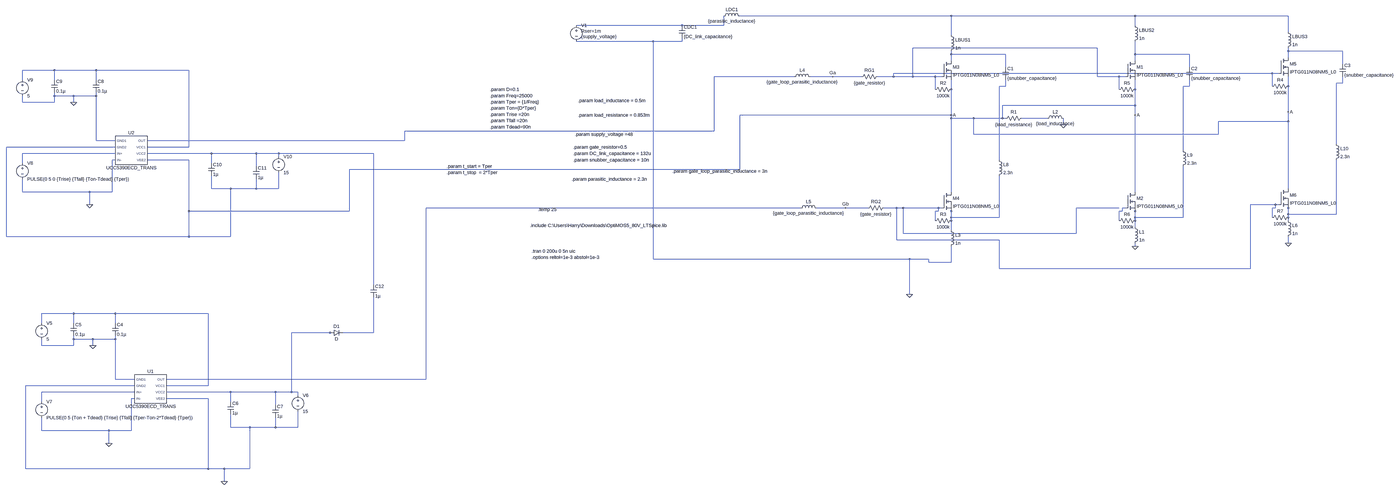
[diagram p0: schematic gate_driver_implementation_3_in_parallel_start_up_conditions.asc, whole sheet]
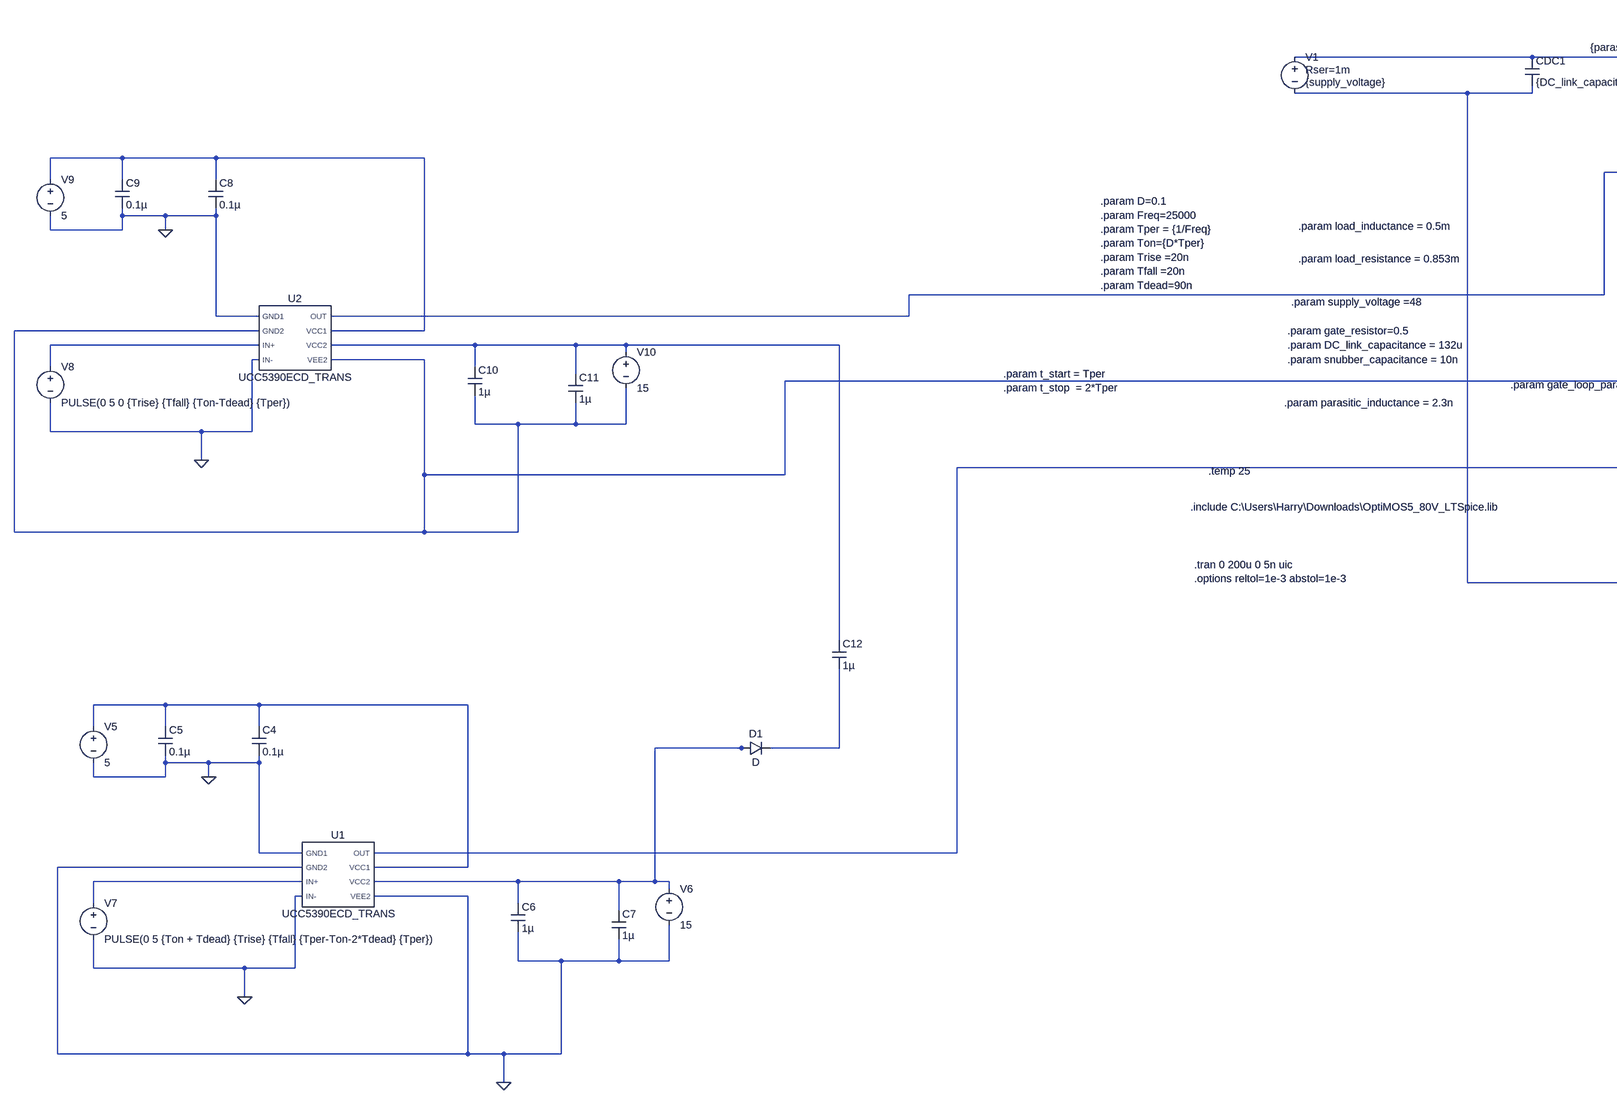
[diagram p1: schematic gate_driver_implementation_3_in_parallel_start_up_conditions.asc, part, row 1 of 1, column 1 of 2]
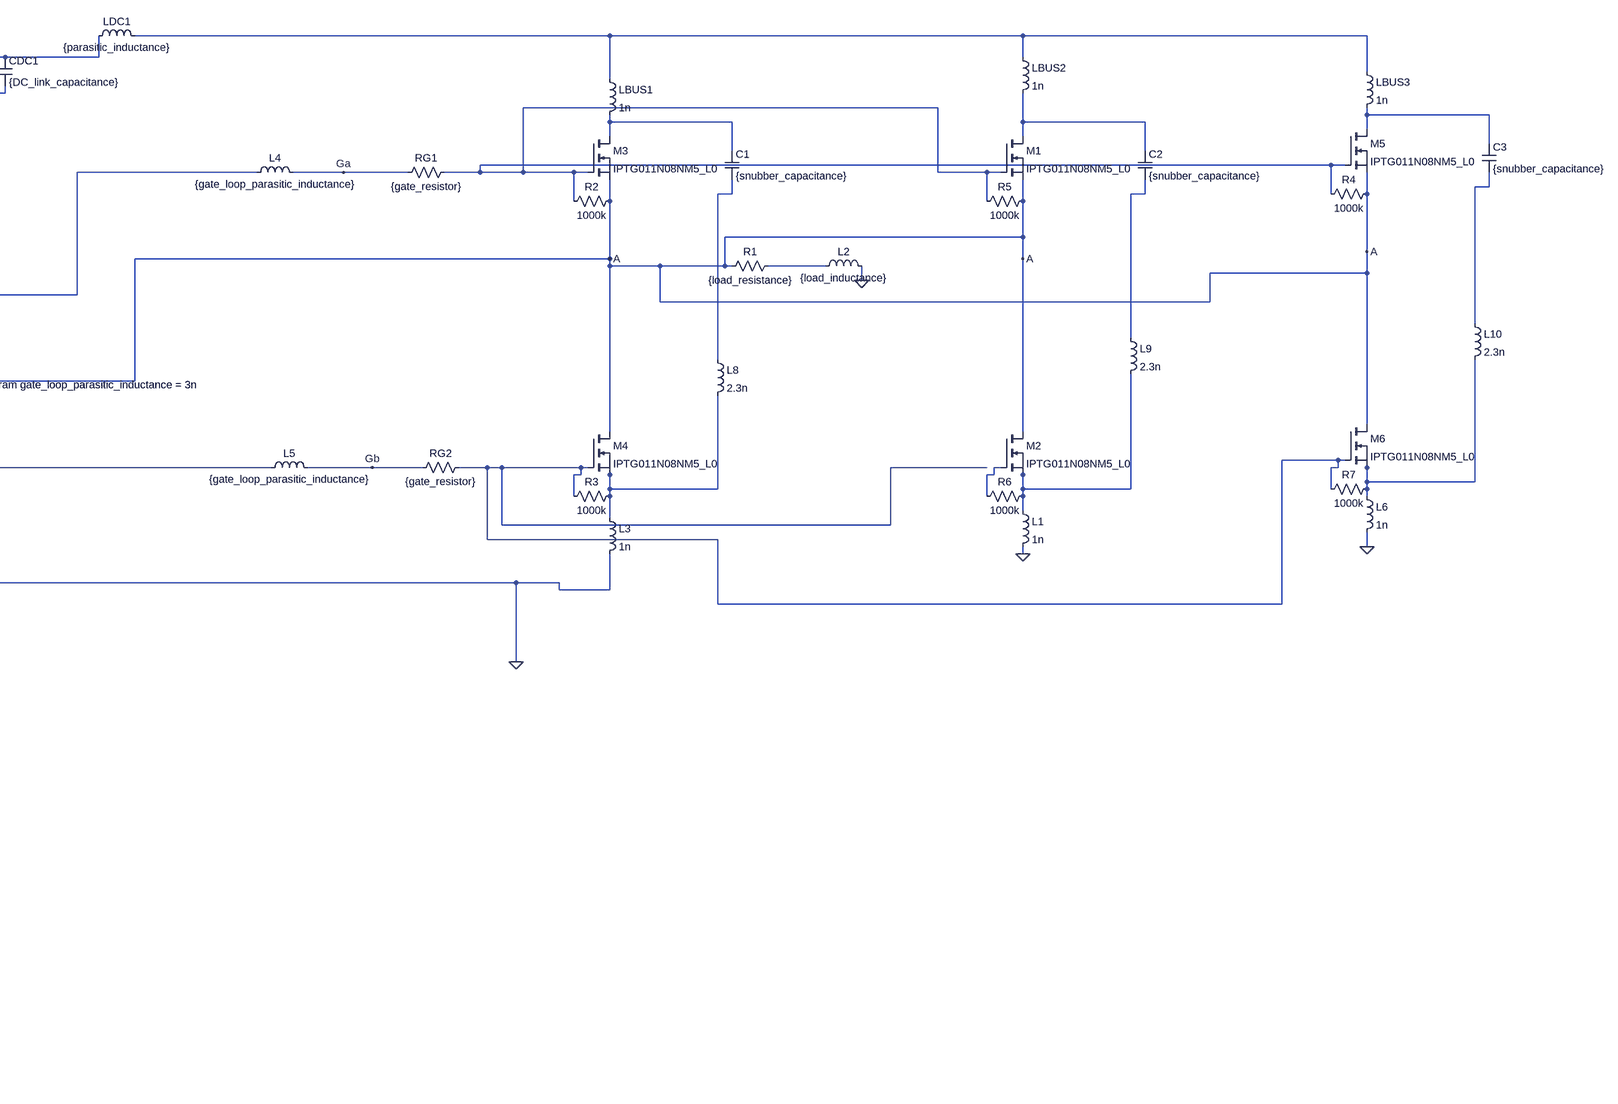
[diagram p2: schematic gate_driver_implementation_3_in_parallel_start_up_conditions.asc, part, row 1 of 1, column 2 of 2]
gate_driver_implementation_3_in_parallel_start_up_conditions.asc, the LTspice schematic file:
Version 4.1
SHEET 1 7924 1844
WIRE 1136 -560 80 -560
WIRE 2176 -560 1136 -560
WIRE 3136 -560 2176 -560
WIRE -208 -512 -736 -512
WIRE 0 -512 0 -560
WIRE 0 -512 -208 -512
WIRE 2176 -512 2176 -560
WIRE 3136 -480 3136 -560
WIRE 1136 -464 1136 -560
WIRE -352 -432 -736 -432
WIRE -208 -432 -208 -448
WIRE -208 -432 -352 -432
WIRE 1920 -400 944 -400
WIRE 3136 -384 3136 -400
WIRE 3408 -384 3136 -384
WIRE 1136 -368 1136 -384
WIRE 1408 -368 1136 -368
WIRE 2176 -368 2176 -432
WIRE 2448 -368 2176 -368
WIRE 3136 -352 3136 -384
WIRE 1136 -336 1136 -368
WIRE 2176 -336 2176 -368
WIRE 3408 -320 3408 -384
WIRE 1408 -304 1408 -368
WIRE 2448 -304 2448 -368
WIRE -4048 -288 -4208 -288
WIRE -3840 -288 -4048 -288
WIRE -3376 -288 -3840 -288
WIRE 3056 -272 848 -272
WIRE 3088 -272 3056 -272
WIRE 352 -256 -48 -256
WIRE 544 -256 432 -256
WIRE 688 -256 544 -256
WIRE 848 -256 848 -272
WIRE 848 -256 768 -256
WIRE 944 -256 944 -400
WIRE 944 -256 848 -256
WIRE 1056 -256 944 -256
WIRE 1088 -256 1056 -256
WIRE 1920 -256 1920 -400
WIRE 2096 -256 1920 -256
WIRE 2128 -256 2096 -256
WIRE -4208 -240 -4208 -288
WIRE -4048 -240 -4048 -288
WIRE -3840 -240 -3840 -288
WIRE 3408 -224 3408 -256
WIRE 3408 -224 3376 -224
WIRE 1408 -208 1408 -240
WIRE 1408 -208 1376 -208
WIRE 2448 -208 2448 -240
WIRE 2448 -208 2416 -208
WIRE 3056 -208 3056 -272
WIRE 3136 -208 3136 -256
WIRE 1056 -192 1056 -256
WIRE 1136 -192 1136 -240
WIRE 2096 -192 2096 -256
WIRE 2176 -192 2176 -240
WIRE -4048 -160 -4048 -176
WIRE -3952 -160 -4048 -160
WIRE -3840 -160 -3840 -176
WIRE -3840 -160 -3952 -160
WIRE -4208 -128 -4208 -160
WIRE -4048 -128 -4048 -160
WIRE -4048 -128 -4208 -128
WIRE -3952 -128 -3952 -160
WIRE 2176 -112 2176 -192
WIRE 2176 -112 1392 -112
WIRE 3136 -80 3136 -208
WIRE 1136 -64 1136 -192
WIRE 1136 -64 80 -64
WIRE 2176 -64 2176 -112
WIRE 1136 -48 1136 -64
WIRE 1248 -48 1136 -48
WIRE 1392 -48 1392 -112
WIRE 1392 -48 1248 -48
WIRE 1408 -48 1392 -48
WIRE 1616 -48 1488 -48
WIRE 3136 -32 3136 -80
WIRE 3136 -32 2592 -32
WIRE 1696 -16 1696 -48
WIRE -48 16 -48 -256
WIRE -48 16 -1952 16
WIRE 1248 32 1248 -48
WIRE 2592 32 2592 -32
WIRE 2592 32 1248 32
WIRE -3840 64 -3840 -160
WIRE -3744 64 -3840 64
WIRE -1952 64 -1952 16
WIRE -1952 64 -3584 64
WIRE 3376 80 3376 -224
WIRE -3744 96 -4288 96
WIRE -3376 96 -3376 -288
WIRE -3376 96 -3584 96
WIRE 2416 112 2416 -208
WIRE -3744 128 -4208 128
WIRE -3264 128 -3584 128
WIRE -3040 128 -3264 128
WIRE -2928 128 -3040 128
WIRE -2384 128 -2928 128
WIRE -2928 144 -2928 128
WIRE -3744 160 -3760 160
WIRE -3376 160 -3584 160
WIRE 1376 160 1376 -208
WIRE -4208 176 -4208 128
WIRE -3264 176 -3264 128
WIRE -3040 192 -3040 128
WIRE 80 208 80 -64
WIRE 80 208 -2560 208
WIRE -3264 304 -3264 240
WIRE -3168 304 -3264 304
WIRE -3040 304 -3040 256
WIRE -3040 304 -3168 304
WIRE -2928 304 -2928 224
WIRE -2928 304 -3040 304
WIRE 3136 304 3136 -32
WIRE -4208 320 -4208 256
WIRE -3872 320 -4208 320
WIRE -3760 320 -3760 160
WIRE -3760 320 -3872 320
WIRE 1136 320 1136 -48
WIRE 2176 320 2176 -64
WIRE -3872 384 -3872 320
WIRE 3072 384 2752 384
WIRE 3088 384 3072 384
WIRE 384 400 -1792 400
WIRE 608 400 464 400
WIRE 720 400 608 400
WIRE 864 400 800 400
WIRE 896 400 864 400
WIRE 1072 400 896 400
WIRE 1088 400 1072 400
WIRE 2096 400 1760 400
WIRE 2128 400 2112 400
WIRE 3072 400 3072 384
WIRE 3072 400 3056 400
WIRE 3136 400 3136 384
WIRE -3376 416 -3376 160
WIRE -2560 416 -2560 208
WIRE -2560 416 -3376 416
WIRE 1072 416 1072 400
WIRE 1072 416 1056 416
WIRE 1136 416 1136 400
WIRE 2112 416 2112 400
WIRE 2112 416 2096 416
WIRE 2176 416 2176 400
WIRE 3136 432 3136 400
WIRE 3376 432 3376 160
WIRE 3376 432 3136 432
WIRE 1136 448 1136 416
WIRE 1376 448 1376 240
WIRE 1376 448 1136 448
WIRE 2176 448 2176 416
WIRE 2416 448 2416 192
WIRE 2416 448 2176 448
WIRE 3056 448 3056 400
WIRE 3136 448 3136 432
WIRE 1056 464 1056 416
WIRE 1136 464 1136 448
WIRE 2096 464 2096 416
WIRE 2176 464 2176 448
WIRE 3136 464 3136 448
WIRE 2176 496 2176 464
WIRE 1136 512 1136 464
WIRE 896 528 896 400
WIRE 1760 528 1760 400
WIRE 1760 528 896 528
WIRE -4288 544 -4288 96
WIRE -3376 544 -3376 416
WIRE -3376 544 -4288 544
WIRE -3168 544 -3168 304
WIRE -3168 544 -3376 544
WIRE 864 560 864 400
WIRE 1376 560 864 560
WIRE 3136 576 3136 544
WIRE 2176 592 2176 576
WIRE -352 656 -352 -432
WIRE 928 656 -352 656
WIRE 1024 656 928 656
WIRE 1024 672 1024 656
WIRE 1136 672 1136 592
WIRE 1136 672 1024 672
WIRE 1376 704 1376 560
WIRE 2752 704 2752 384
WIRE 2752 704 1376 704
WIRE -2384 784 -2384 128
WIRE 928 832 928 656
WIRE -3952 928 -4112 928
WIRE -3744 928 -3952 928
WIRE -3280 928 -3744 928
WIRE -4112 976 -4112 928
WIRE -3952 976 -3952 928
WIRE -3744 976 -3744 928
WIRE -2656 1024 -2864 1024
WIRE -2640 1024 -2656 1024
WIRE -2384 1024 -2384 848
WIRE -2384 1024 -2592 1024
WIRE -3952 1056 -3952 1040
WIRE -3856 1056 -3952 1056
WIRE -3744 1056 -3744 1040
WIRE -3744 1056 -3856 1056
WIRE -4112 1088 -4112 1056
WIRE -3952 1088 -3952 1056
WIRE -3952 1088 -4112 1088
WIRE -3856 1088 -3856 1056
WIRE -3744 1280 -3744 1056
WIRE -3648 1280 -3744 1280
WIRE -1792 1280 -1792 400
WIRE -1792 1280 -3488 1280
WIRE -3648 1312 -4192 1312
WIRE -3280 1312 -3280 928
WIRE -3280 1312 -3488 1312
WIRE -3648 1344 -4112 1344
WIRE -3168 1344 -3488 1344
WIRE -2944 1344 -3168 1344
WIRE -2864 1344 -2864 1024
WIRE -2864 1344 -2944 1344
WIRE -2832 1344 -2864 1344
WIRE -2832 1360 -2832 1344
WIRE -3648 1376 -3664 1376
WIRE -3280 1376 -3488 1376
WIRE -4112 1392 -4112 1344
WIRE -3168 1392 -3168 1344
WIRE -2944 1408 -2944 1344
WIRE -3168 1520 -3168 1456
WIRE -3072 1520 -3168 1520
WIRE -2944 1520 -2944 1472
WIRE -2944 1520 -3072 1520
WIRE -2832 1520 -2832 1440
WIRE -2832 1520 -2944 1520
WIRE -4112 1536 -4112 1472
WIRE -3776 1536 -4112 1536
WIRE -3664 1536 -3664 1376
WIRE -3664 1536 -3776 1536
WIRE -3776 1600 -3776 1536
WIRE -4192 1760 -4192 1312
WIRE -3280 1760 -3280 1376
WIRE -3280 1760 -4192 1760
WIRE -3200 1760 -3280 1760
WIRE -3072 1760 -3072 1520
WIRE -3072 1760 -3200 1760
WIRE -3200 1824 -3200 1760
FLAG 544 -256 Ga
FLAG 608 400 Gb
FLAG 1696 -16 0
FLAG 1136 -64 A
FLAG 928 832 0
FLAG 2176 -64 A
FLAG 2176 592 0
FLAG 3136 -80 A
FLAG 3136 576 0
FLAG -3856 1088 0
FLAG -3776 1600 0
FLAG -3200 1824 0
FLAG -3952 -128 0
FLAG -3872 384 0
SYMBOL voltage -736 -528 R0
WINDOW 123 0 0 Left 0
WINDOW 39 24 44 Left 2
WINDOW 3 24 72 Left 2
SYMATTR SpiceLine Rser=1m
SYMATTR Value {supply_voltage}
SYMATTR InstName V1
SYMBOL cap -224 -512 R0
SYMATTR InstName CDC1
SYMATTR Value {DC_link_capacitance}
SYMATTR SpiceLine Rser=1m
SYMBOL ind -16 -544 R270
WINDOW 0 32 56 VTop 2
WINDOW 3 5 56 VBottom 2
SYMATTR InstName LDC1
SYMATTR Value {parasitic_inductance}
SYMATTR SpiceLine Rser=1m
SYMBOL res 1504 -64 R90
WINDOW 0 0 56 VBottom 2
WINDOW 3 32 56 VTop 2
SYMATTR InstName R1
SYMATTR Value {load_resistance}
SYMBOL res 784 -272 R90
WINDOW 0 0 56 VBottom 2
WINDOW 3 32 56 VTop 2
SYMATTR InstName RG1
SYMATTR Value {gate_resistor}
SYMBOL res 816 384 R90
WINDOW 0 0 56 VBottom 2
WINDOW 3 32 56 VTop 2
SYMATTR InstName RG2
SYMATTR Value {gate_resistor}
SYMBOL ind 1120 -480 R0
SYMATTR InstName LBUS1
SYMATTR Value 1n
SYMATTR SpiceLine Rser=1m
SYMBOL ind 1600 -32 R270
WINDOW 0 32 56 VTop 2
WINDOW 3 5 56 VBottom 2
SYMATTR InstName L2
SYMATTR Value {load_inductance}
SYMATTR SpiceLine Rser=1m
SYMBOL ind 1120 496 R0
SYMATTR InstName L3
SYMATTR Value 1n
SYMATTR SpiceLine Rser=1m
SYMBOL ind 336 -240 R270
WINDOW 0 32 56 VTop 2
WINDOW 3 5 56 VBottom 2
SYMATTR InstName L4
SYMATTR Value {gate_loop_parasitic_inductance}
SYMATTR SpiceLine Rser=1m
SYMBOL ind 368 416 R270
WINDOW 0 32 56 VTop 2
WINDOW 3 5 56 VBottom 2
SYMATTR InstName L5
SYMATTR Value {gate_loop_parasitic_inductance}
SYMATTR SpiceLine Rser=1m
SYMBOL res 1152 -208 R90
WINDOW 0 0 56 VBottom 2
WINDOW 3 32 56 VTop 2
SYMATTR InstName R2
SYMATTR Value 1000k
SYMBOL res 1152 448 R90
WINDOW 0 0 56 VBottom 2
WINDOW 3 32 56 VTop 2
SYMATTR InstName R3
SYMATTR Value 1000k
SYMBOL cap 1392 -304 R0
SYMATTR InstName C1
SYMATTR Value {snubber_capacitance}
SYMBOL nmos 1088 -336 R0
SYMATTR InstName M3
SYMATTR Value IPTG011N08NM5_L0
SYMATTR Prefix X
SYMBOL nmos 1088 320 R0
SYMATTR InstName M4
SYMATTR Value IPTG011N08NM5_L0
SYMATTR Prefix X
SYMBOL res 2192 -208 R90
WINDOW 0 0 56 VBottom 2
WINDOW 3 32 56 VTop 2
SYMATTR InstName R5
SYMATTR Value 1000k
SYMBOL res 2192 448 R90
WINDOW 0 0 56 VBottom 2
WINDOW 3 32 56 VTop 2
SYMATTR InstName R6
SYMATTR Value 1000k
SYMBOL cap 2432 -304 R0
SYMATTR InstName C2
SYMATTR Value {snubber_capacitance}
SYMBOL nmos 2128 -336 R0
SYMATTR InstName M1
SYMATTR Value IPTG011N08NM5_L0
SYMATTR Prefix X
SYMBOL nmos 2128 320 R0
SYMATTR InstName M2
SYMATTR Value IPTG011N08NM5_L0
SYMATTR Prefix X
SYMBOL res 3152 -224 R90
WINDOW 0 0 56 VBottom 2
WINDOW 3 32 56 VTop 2
SYMATTR InstName R4
SYMATTR Value 1000k
SYMBOL res 3152 432 R90
WINDOW 0 0 56 VBottom 2
WINDOW 3 32 56 VTop 2
SYMATTR InstName R7
SYMATTR Value 1000k
SYMBOL cap 3392 -320 R0
SYMATTR InstName C3
SYMATTR Value {snubber_capacitance}
SYMBOL nmos 3088 -352 R0
SYMATTR InstName M5
SYMATTR Value IPTG011N08NM5_L0
SYMATTR Prefix X
SYMBOL nmos 3088 304 R0
SYMATTR InstName M6
SYMATTR Value IPTG011N08NM5_L0
SYMATTR Prefix X
SYMBOL ind 2160 -528 R0
SYMATTR InstName LBUS2
SYMATTR Value 1n
SYMATTR SpiceLine Rser=1m
SYMBOL ind 3120 -496 R0
SYMATTR InstName LBUS3
SYMATTR Value 1n
SYMATTR SpiceLine Rser=1m
SYMBOL ind 1360 144 R0
SYMATTR InstName L8
SYMATTR Value 2.3n
SYMATTR SpiceLine Rser=1m
SYMBOL ind 2400 96 R0
SYMATTR InstName L9
SYMATTR Value 2.3n
SYMATTR SpiceLine Rser=1m
SYMBOL ind 3360 64 R0
SYMATTR InstName L10
SYMATTR Value 2.3n
SYMATTR SpiceLine Rser=1m
SYMBOL ind 2160 480 R0
SYMATTR InstName L1
SYMATTR Value 1n
SYMATTR SpiceLine Rser=1m
SYMBOL ind 3120 448 R0
SYMATTR InstName L6
SYMATTR Value 1n
SYMATTR SpiceLine Rser=1m
SYMBOL UCC5390ECD_TRANS -3568 1328 R0
SYMATTR InstName U1
SYMBOL voltage -4112 960 R0
WINDOW 123 0 0 Left 0
WINDOW 39 0 0 Left 0
SYMATTR InstName V5
SYMATTR Value 5
SYMBOL voltage -2832 1344 R0
WINDOW 123 0 0 Left 0
WINDOW 39 0 0 Left 0
SYMATTR InstName V6
SYMATTR Value 15
SYMBOL cap -3760 976 R0
SYMATTR InstName C4
SYMATTR Value 0.1µ
SYMBOL cap -3968 976 R0
SYMATTR InstName C5
SYMATTR Value 0.1µ
SYMBOL cap -3184 1392 R0
SYMATTR InstName C6
SYMATTR Value 1µ
SYMBOL cap -2960 1408 R0
SYMATTR InstName C7
SYMATTR Value 1µ
SYMBOL voltage -4112 1376 R0
WINDOW 123 0 0 Left 0
WINDOW 39 0 0 Left 0
SYMATTR InstName V7
SYMATTR Value PULSE(0 5 {Ton + Tdead} {Trise} {Tfall} {Tper-Ton-2*Tdead} {Tper})
SYMBOL voltage -4208 160 R0
WINDOW 123 0 0 Left 0
WINDOW 39 0 0 Left 0
SYMATTR InstName V8
SYMATTR Value PULSE(0 5 0 {Trise} {Tfall} {Ton-Tdead} {Tper})
SYMBOL UCC5390ECD_TRANS -3664 112 R0
SYMATTR InstName U2
SYMBOL voltage -4208 -256 R0
WINDOW 123 0 0 Left 0
WINDOW 39 0 0 Left 0
SYMATTR InstName V9
SYMATTR Value 5
SYMBOL voltage -2928 128 R0
WINDOW 123 0 0 Left 0
WINDOW 39 0 0 Left 0
SYMATTR InstName V10
SYMATTR Value 15
SYMBOL cap -3856 -240 R0
SYMATTR InstName C8
SYMATTR Value 0.1µ
SYMBOL cap -4064 -240 R0
SYMATTR InstName C9
SYMATTR Value 0.1µ
SYMBOL cap -3280 176 R0
SYMATTR InstName C10
SYMATTR Value 1µ
SYMBOL cap -3056 192 R0
SYMATTR InstName C11
SYMATTR Value 1µ
SYMBOL diode -2656 1040 R270
WINDOW 0 32 32 VTop 2
WINDOW 3 0 32 VBottom 2
SYMATTR InstName D1
SYMBOL cap -2400 784 R0
SYMATTR InstName C12
SYMATTR Value 1µ
TEXT -1168 -192 Left 2 !.param D=0.1\n.param Freq=25000\n.param Tper = {1/Freq}\n.param Ton={D*Tper}\n.param Trise =20n\n.param Tfall =20n\n.param Tdead=90n
TEXT -960 616 Left 2 !.tran 0 200u 0 5n uic\n.options reltol=1e-3 abstol=1e-3
TEXT -968 488 Left 2 !.include C:\\Users\\Harry\\Downloads\\OptiMOS5_80V_LTSpice.lib
TEXT -928 408 Left 2 !.temp 25
TEXT -752 160 Left 2 !.param snubber_capacitance = 10n
TEXT -752 128 Left 2 !.param DC_link_capacitance = 132u
TEXT -752 96 Left 2 !.param gate_resistor=0.5
TEXT -744 32 Left 2 !.param supply_voltage =48
TEXT -728 -64 Left 2 !.param load_resistance = 0.853m
TEXT -728 -136 Left 2 !.param load_inductance = 0.5m
TEXT -760 256 Left 2 !.param parasitic_inductance = 2.3n
TEXT -256 216 Left 2 !.param gate_loop_parasitic_inductance = 3n
TEXT -1384 192 Left 2 !.param t_start = Tper\n.param t_stop  = 2*Tper

The netlist it stands for:
* gate_driver_implementation_3_in_parallel_start_up_conditions.asc
V1 N002 0 {supply_voltage} Rser=1m
CDC1 N002 0 {DC_link_capacitance} Rser=1m
LDC1 N002 N001 {parasitic_inductance} Rser=1m
R1 N012 A {load_resistance}
RG1 N003 Ga {gate_resistor}
RG2 N015 Gb {gate_resistor}
LBUS1 N001 N005 1n Rser=1m
L2 N012 0 {load_inductance} Rser=1m
L3 N019 0 1n Rser=1m
L4 N008 Ga {gate_loop_parasitic_inductance} Rser=1m
L5 N016 Gb {gate_loop_parasitic_inductance} Rser=1m
R2 A N003 1000k
R3 N019 N015 1000k
C1 N005 N010 {snubber_capacitance}
X§M3 N005 N003 A IPTG011N08NM5_L0  ; pins D G S
X§M4 A N015 N019 IPTG011N08NM5_L0  ; pins D G S
R5 A N003 1000k
R6 N020 N017 1000k
C2 N006 N011 {snubber_capacitance}
X§M1 N006 N003 A IPTG011N08NM5_L0  ; pins D G S
X§M2 A N017 N020 IPTG011N08NM5_L0  ; pins D G S
R4 A N003 1000k
R7 N018 N015 1000k
C3 N004 N009 {snubber_capacitance}
X§M5 N004 N003 A IPTG011N08NM5_L0  ; pins D G S
X§M6 A N015 N018 IPTG011N08NM5_L0  ; pins D G S
LBUS2 N001 N006 1n Rser=1m
LBUS3 N001 N004 1n Rser=1m
L8 N010 N019 2.3n Rser=1m
L9 N011 N020 2.3n Rser=1m
L10 N009 N018 2.3n Rser=1m
L1 N020 0 1n Rser=1m
L6 N018 0 1n Rser=1m
X§U1 0 0 N024 0 N016 N021 N022 0 UCC5390ECD_TRANS  ; pins GND1 GND2 IN+ IN- OUT VCC1 VCC2 VEE2
V5 N021 0 5
V6 N022 0 15
C4 N021 0 0.1µ
C5 N021 0 0.1µ
C6 N022 0 1µ
C7 N022 0 1µ
V7 N024 0 PULSE(0 5 {Ton + Tdead} {Trise} {Tfall} {Tper-Ton-2*Tdead} {Tper})
V8 N013 0 PULSE(0 5 0 {Trise} {Tfall} {Ton-Tdead} {Tper})
X§U2 0 A N013 0 N008 N007 N014 A UCC5390ECD_TRANS  ; pins GND1 GND2 IN+ IN- OUT VCC1 VCC2 VEE2
V9 N007 0 5
V10 N014 A 15
C8 N007 0 0.1µ
C9 N007 0 0.1µ
C10 N014 A 1µ
C11 N014 A 1µ
D1 N022 N023 D
C12 N014 N023 1µ
.model D D
.lib standard.dio
.param D=0.1
.param Freq=25000
.param Tper = {1/Freq}
.param Ton={D*Tper}
.param Trise =20n
.param Tfall =20n
.param Tdead=90n
.tran 0 200u 0 5n uic
.options reltol=1e-3 abstol=1e-3
.include C:\Users\Harry\Downloads\OptiMOS5_80V_LTSpice.lib
.temp 25
.param snubber_capacitance = 10n
.param DC_link_capacitance = 132u
.param gate_resistor=0.5
.param supply_voltage =48
.param load_resistance = 0.853m
.param load_inductance = 0.5m
.param parasitic_inductance = 2.3n
.param gate_loop_parasitic_inductance = 3n
.param t_start = Tper
.param t_stop  = 2*Tper
.lib UCC5390ECD_TRANS.LIB
.backanno
.end